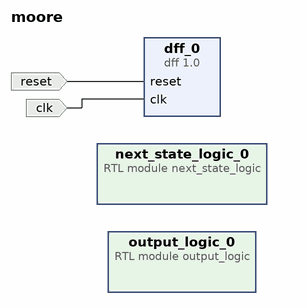
[diagram p0: block diagram of the top level]
# Vivado block design moore, xc7a35tcpg236-1, Vivado 2018.3
create_bd_design moore

create_bd_port -dir I reset
create_bd_port -dir I clk

create_bd_cell -type module -reference next_state_logic next_state_logic_0
create_bd_cell -type module -reference output_logic output_logic_0
create_bd_cell -type ip -vlnv FIT:user:dff:1.0 dff_0

# ---- connections ----

connect_bd_net -net reset_0_1 [get_bd_ports reset] [get_bd_pins dff_0/reset]
connect_bd_net -net clk_0_1 [get_bd_ports clk] [get_bd_pins dff_0/clk]

validate_bd_design
save_bd_design
